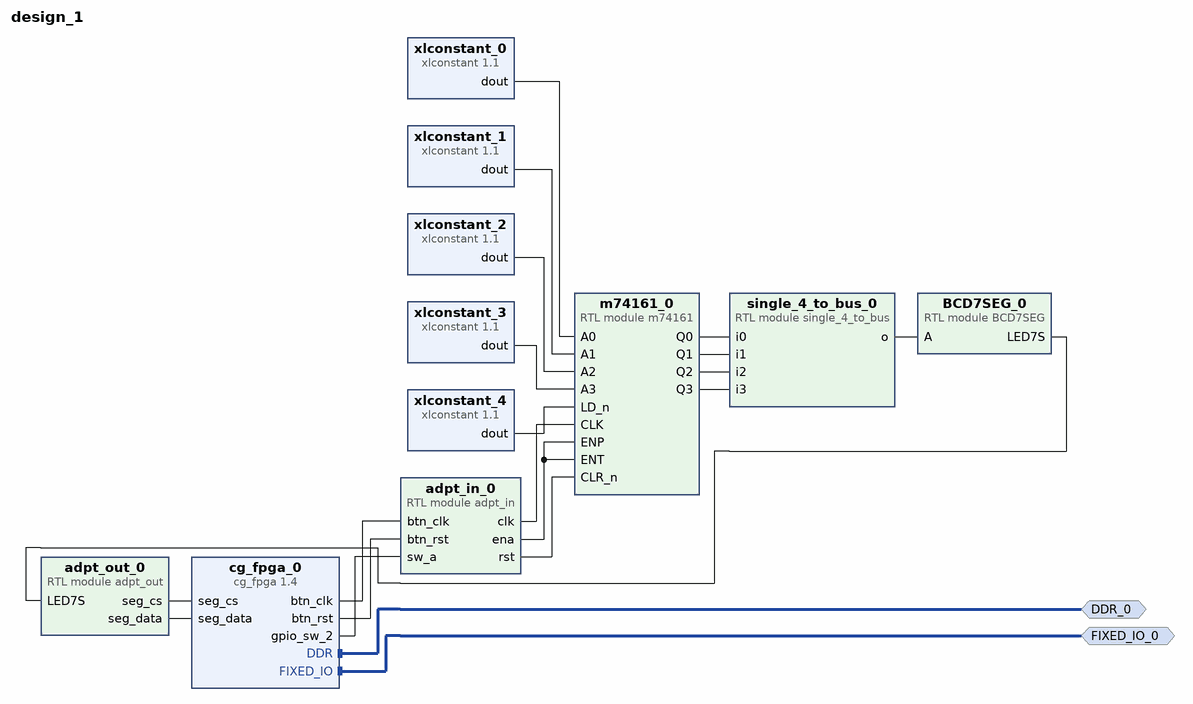
[diagram p0: block diagram of the top level]
# Vivado block design design_1, xc7z020clg400-1, Vivado 2025.2
create_bd_design design_1

create_bd_intf_port -mode Master -vlnv xilinx.com:display_processing_system7:fixedio_rtl:1.0 FIXED_IO_0
create_bd_intf_port -mode Master -vlnv xilinx.com:interface:ddrx_rtl:1.0 DDR_0

create_bd_cell -type ip -vlnv educg.net:user:cg_fpga:1.4 cg_fpga_0
create_bd_cell -type module -reference adpt_in adpt_in_0
create_bd_cell -type module -reference m74161 m74161_0
create_bd_cell -type module -reference single_4_to_bus single_4_to_bus_0
create_bd_cell -type module -reference adpt_out adpt_out_0
create_bd_cell -type module -reference BCD7SEG BCD7SEG_0
create_bd_cell -type ip -vlnv xilinx.com:ip:xlconstant:1.1 xlconstant_0
create_bd_cell -type ip -vlnv xilinx.com:ip:xlconstant:1.1 xlconstant_1
create_bd_cell -type ip -vlnv xilinx.com:ip:xlconstant:1.1 xlconstant_2
create_bd_cell -type ip -vlnv xilinx.com:ip:xlconstant:1.1 xlconstant_3
create_bd_cell -type ip -vlnv xilinx.com:ip:xlconstant:1.1 xlconstant_4

# ---- connections ----

connect_bd_intf_net [get_bd_intf_ports DDR_0] [get_bd_intf_pins cg_fpga_0/DDR]
connect_bd_intf_net [get_bd_intf_ports FIXED_IO_0] [get_bd_intf_pins cg_fpga_0/FIXED_IO]
connect_bd_net [get_bd_pins BCD7SEG_0/LED7S] [get_bd_pins adpt_out_0/LED7S]
connect_bd_net [get_bd_pins adpt_in_0/clk] [get_bd_pins m74161_0/CLK]
connect_bd_net [get_bd_pins adpt_in_0/ena] [get_bd_pins m74161_0/ENP] [get_bd_pins m74161_0/ENT]
connect_bd_net [get_bd_pins adpt_in_0/rst] [get_bd_pins m74161_0/CLR_n]
connect_bd_net [get_bd_pins adpt_out_0/seg_cs] [get_bd_pins cg_fpga_0/seg_cs]
connect_bd_net [get_bd_pins adpt_out_0/seg_data] [get_bd_pins cg_fpga_0/seg_data]
connect_bd_net [get_bd_pins cg_fpga_0/btn_clk] [get_bd_pins adpt_in_0/btn_clk]
connect_bd_net [get_bd_pins cg_fpga_0/btn_rst] [get_bd_pins adpt_in_0/btn_rst]
connect_bd_net [get_bd_pins cg_fpga_0/gpio_sw_2] [get_bd_pins adpt_in_0/sw_a]
connect_bd_net [get_bd_pins m74161_0/Q0] [get_bd_pins single_4_to_bus_0/i0]
connect_bd_net [get_bd_pins m74161_0/Q1] [get_bd_pins single_4_to_bus_0/i1]
connect_bd_net [get_bd_pins m74161_0/Q2] [get_bd_pins single_4_to_bus_0/i2]
connect_bd_net [get_bd_pins m74161_0/Q3] [get_bd_pins single_4_to_bus_0/i3]
connect_bd_net [get_bd_pins single_4_to_bus_0/o] [get_bd_pins BCD7SEG_0/A]
connect_bd_net [get_bd_pins xlconstant_0/dout] [get_bd_pins m74161_0/A0]
connect_bd_net [get_bd_pins xlconstant_1/dout] [get_bd_pins m74161_0/A1]
connect_bd_net [get_bd_pins xlconstant_2/dout] [get_bd_pins m74161_0/A2]
connect_bd_net [get_bd_pins xlconstant_3/dout] [get_bd_pins m74161_0/A3]
connect_bd_net [get_bd_pins xlconstant_4/dout] [get_bd_pins m74161_0/LD_n]

validate_bd_design
save_bd_design
